# EAGLE design lueur (EAGLE 9.5.2)
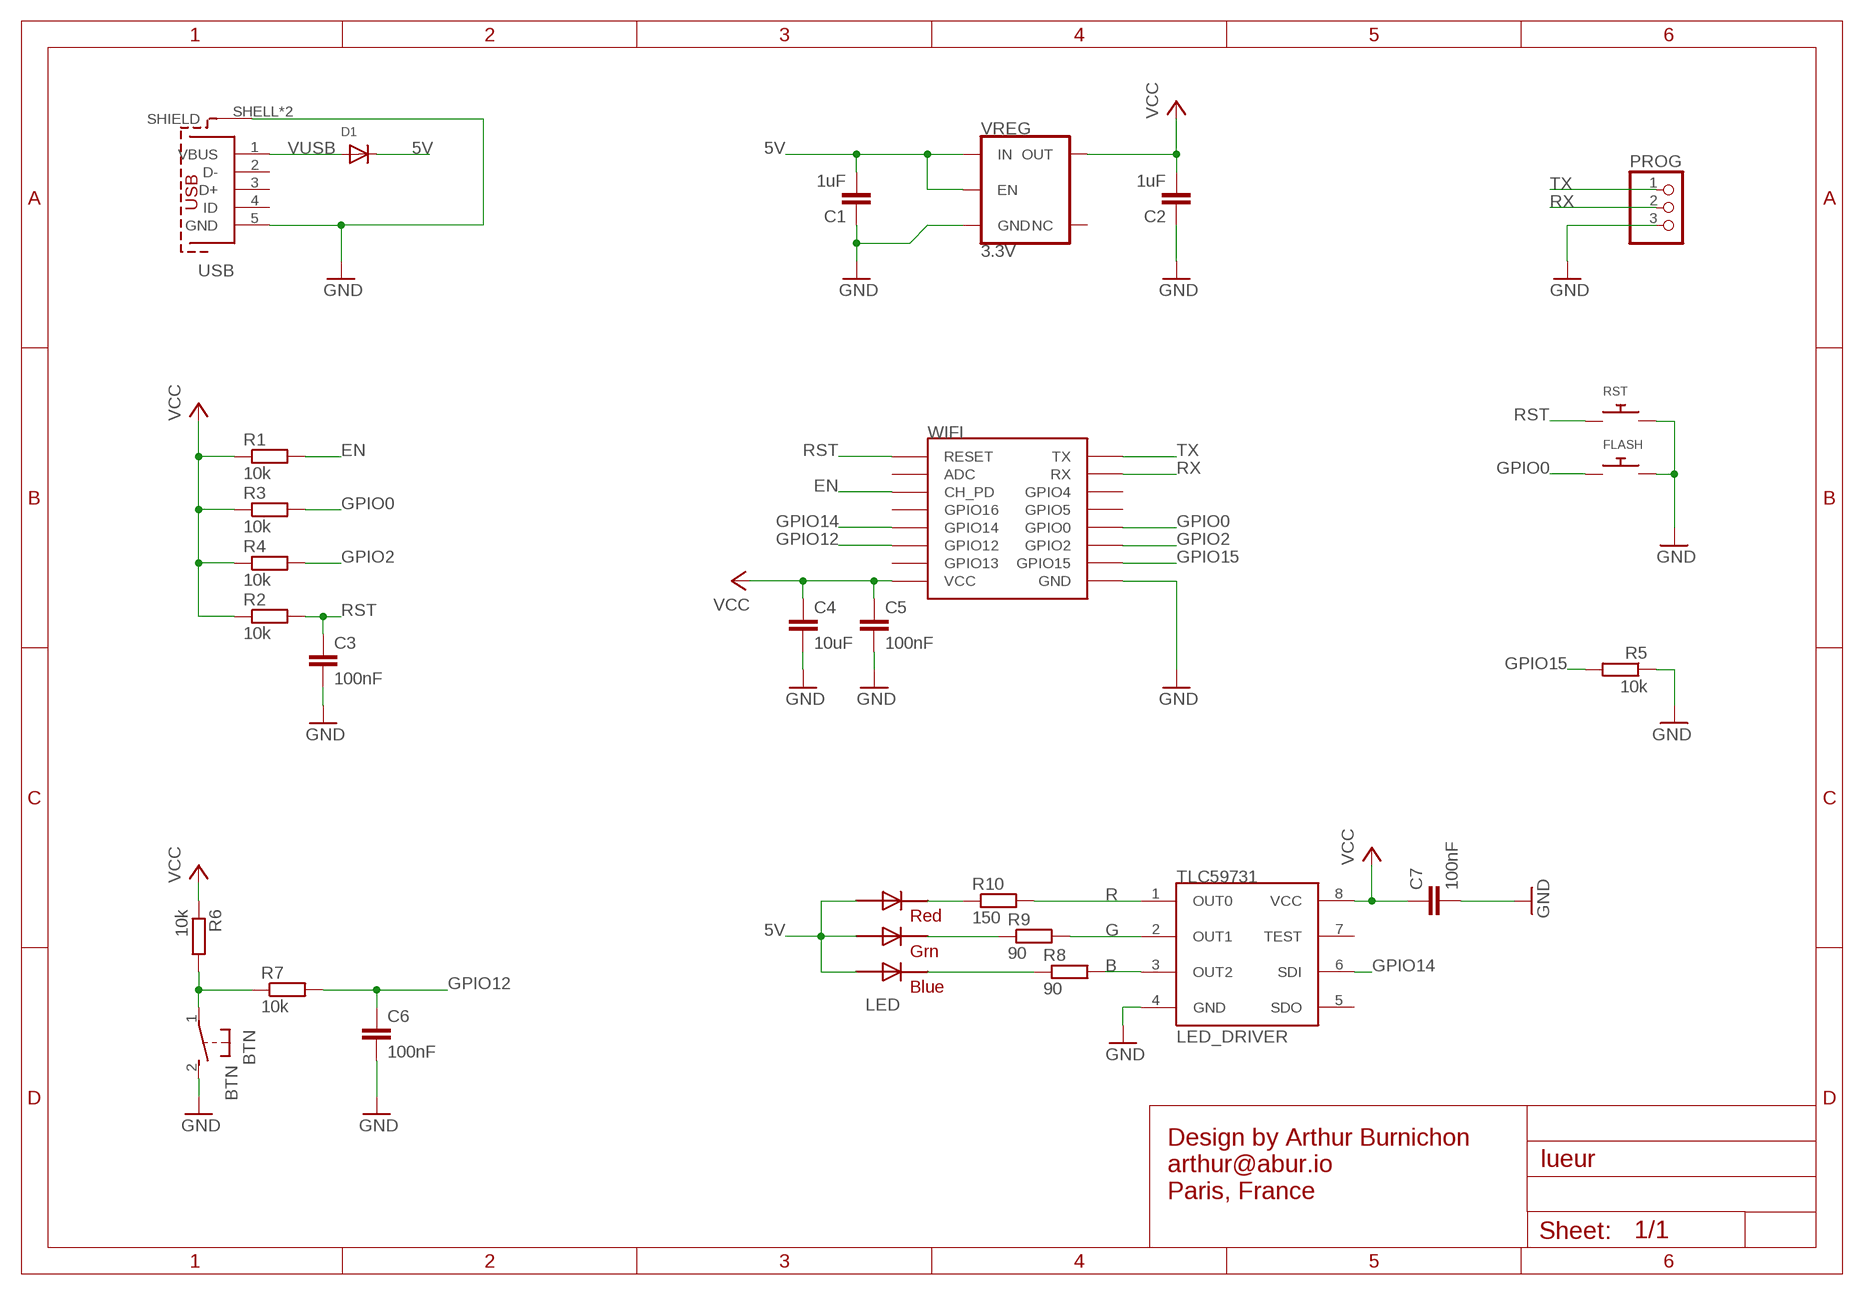
[diagram p0: schematic, sheet 1]

## Parts
BTN  BTN  31-XX  [B3F-31XX]
C1  1uF  C-EUC0805  [C0805]
C2  1uF  C-EUC0805  [C0805]
C3  100nF  C-EUC0805  [C0805]
C4  10uF  C-EUC0805  [C0805]
C5  100nF  C-EUC0805  [C0805]
C6  100nF  C-EUC0805  [C0805]
C7  100nF  C-EUC0805  [C0805]
D1  DIODESMA  [SMADIODE]
FLASH  SWITCH_PUSHBUTTONSOFTTOUCHSMD_SJ  [PUSHBUTTON_SMD_SJ]
LED  RGB5555  [RGBLED5050]
LED_DRIVER  TLC59731  [SOIC8]
PROG  PINHD-1X3  [1X03]
R1  10k  R-EU_R0805  [R0805]
R2  10k  R-EU_R0805  [R0805]
R3  10k  R-EU_R0805  [R0805]
R4  10k  R-EU_R0805  [R0805]
R5  10k  R-EU_R0805  [R0805]
R6  10k  R-EU_R0805  [R0805]
R7  10k  R-EU_R0805  [R0805]
R8  90  R-EU_R0805  [R0805]
R9  90  R-EU_R0805  [R0805]
R10  150  R-EU_R0805  [R0805]
RST  SWITCH_PUSHBUTTONSOFTTOUCHSMD_SJ  [PUSHBUTTON_SMD_SJ]
USB  614105150721  [614105150721]
VREG  3.3V  V_REG_AP2112K-3.3V  [SOT23-5]
WIFI  ESP12SMD  [ESP12-SMD]

## Nets
5V: C1.2 D1.C LED.4(RED_A) LED.5(GREEN_A) LED.6(BLUE_A) VREG.1(IN) VREG.3(EN)
B: LED_DRIVER.3(OUT2) R8.2
BTN: BTN.1(P) R6.2 R7.1
EN: R1.2 WIFI.CH_PD
G: LED_DRIVER.2(OUT1) R9.2
GND: BTN.2(S) C1.1 C2.1 C3.2 C4.2 C5.2 C6.2 C7.2 FLASH.P$2 LED_DRIVER.4(GND) PROG.3 R5.1 RST.P$2 USB.5(GND) USB.SHELL1(SHIELD) USB.SHELL(SHIELD) VREG.2(GND) WIFI.GND
GPIO0: FLASH.P$1 R3.2 WIFI.GPIO0
GPIO2: R4.2 WIFI.GPIO2
GPIO12: C6.1 R7.2 WIFI.GPIO12
GPIO14: LED_DRIVER.6(SDI) WIFI.GPIO14
GPIO15: R5.2 WIFI.GPIO15
N$3: LED.3(RED_C) R10.1
N$7: LED.2(GREEN_C) R9.1
N$8: LED.1(BLUE_C) R8.1
R: LED_DRIVER.1(OUT0) R10.2
RST: C3.1 R2.2 RST.P$1 WIFI.RESET
RX: PROG.2 WIFI.RXD0(RX)
TX: PROG.1 WIFI.TXD0(TX)
VCC: C2.2 C4.1 C5.1 C7.1 LED_DRIVER.8(VCC) R1.1 R2.1 R3.1 R4.1 R6.1 VREG.5(OUT) WIFI.VCC
VUSB: D1.A USB.1(VBUS)
Unconnected: LED_DRIVER.5(SDO) LED_DRIVER.7(TEST) USB.2(D-) USB.3(D+) USB.4(ID) VREG.4(NC) WIFI.ADC WIFI.GPIO4 WIFI.GPIO5 WIFI.GPIO13 WIFI.GPIO16

## Notes on the sheet
- Design by Arthur Burnichon
  arthur@abur.io
  Paris, France

## Library data of the parts
BTN = adafruit:31-XX: OMRON SWITCH Now with beefier pads!
C1-C7 = rcl:C-EU: CAPACITOR, European symbol
D1 = adafruit:DIODE: Diode SMADIODE - SMA Surface Mount Package 20V 1A Schottky Diode Digikey: 641-1014-6-ND DO-1N4148 - Through Hole Small Current Diode SOD-123 20V 1 A (.5mV Vf) Schottky Diode - Digikey: MBRX120TPMSCT-ND SOD-323 10V 570mA (.38mV Vf, 3ns) Schottky Diode - Digikey: ZLLS410CT-ND SOD-523 30V 30mA Schottky Diode (RB751S-40TE61) - Digikey: RB751S-40TE61CT-ND SOT23-R/W - SOT23 Package (R = Solder Paste/Reflow Ovens, W = Hand-Soldering) BAT54Film 40V 300mA - Digikey: 497-7162-1-ND
FLASH RST = adafruit:SWITCH_PUSHBUTTON: Buttons SOFTTOUCHSMD_SJ - Soft touch temporary push button (Super Junk Akihabara) Compatible with SKPMANE010 [Mouser: 688-SKPMAN] C&K_KSS = Digikey: KSS221GLFS
LED = luseed:RGB5555
LED_DRIVER = luseed:TLC59731
PROG = pinhead:PINHD-1X3: PIN HEADER
R1-R10 = rcl:R-EU_: RESISTOR, European symbol
USB = EAGLE-INPUT_OUTPUT_CONNECTORS-rev16c:614105150721: WR-COM_USB_Micro Type B_Vertical_THT; Micro Type B Vertical THT- Tape & Reel not for Pick & Place machine Code : Con_I-O_COM_USB_2.0_B_614105150721_614105150721 <http://katalog.we-online.de/media/images/eican/Con_I-O_COM_USB_2.0_B_614105150721_pf2.jpg> Details see: http://katalog.we-online.de/em/datasheet/614105150721.pdf Created 12/08/2014, Dan Xu 2014 (C) Wurth Elektronik
VREG = SparkFun-IC-Power:V_REG_AP2112: AP2112 - 600mA CMOS LDO Regulator w/ Enable The AP2112 is CMOS process low dropout linear regulator with enable function, the regulator delivers a guaranteed 600mA (min.) continuous load current. Features Output Voltage Accuracy: ±1.5% Output Current: 600mA (Min.) Foldback Short Current Protection: 50mA Enable Function to Turn ON/OFF VOUT Low Dropout Voltage (3.3V): 250mV (Typ.) @IOUT=600mA Excellent Load Regulation: 0.2%/A (Typ.) Excellent Line Regulation: 0.02%/V (Typ.) Low Quiescent Current: 55μA (Typ.) Low Standby Current: 0.01μA (Typ.) Low Output Noise: 50μVRMS PSRR: 100Hz -65dB, 1kHz -65dB OTSD Protection Stable with 1.0μF Flexible Cap: Ceramic, Tantalum and Aluminum Electrolytic Operation Temperature Range: -40°C to 85°C ESD: MM 400V, HBM 4000V; PROD_ID: VREG-12457
WIFI = esp8266modules:ESP12: ESP8266 Wifi module 12

## Board
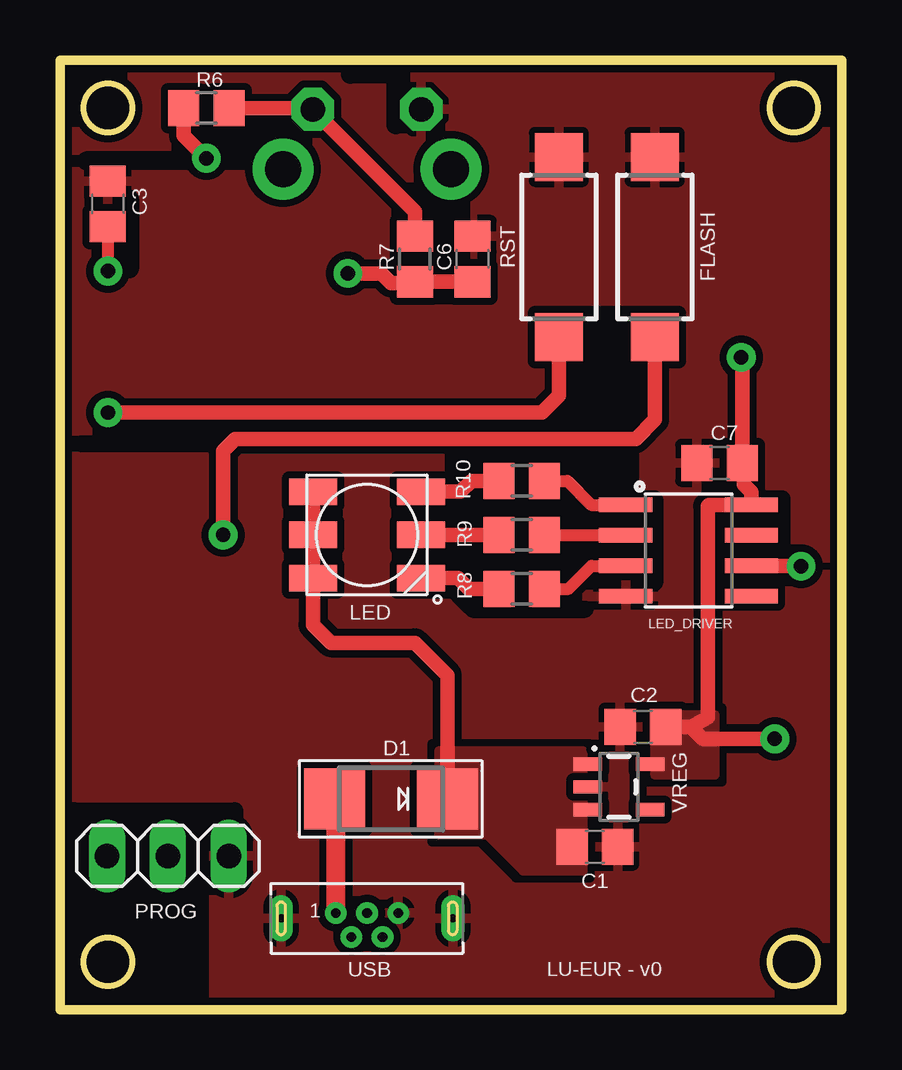
[diagram p1: board, top side]
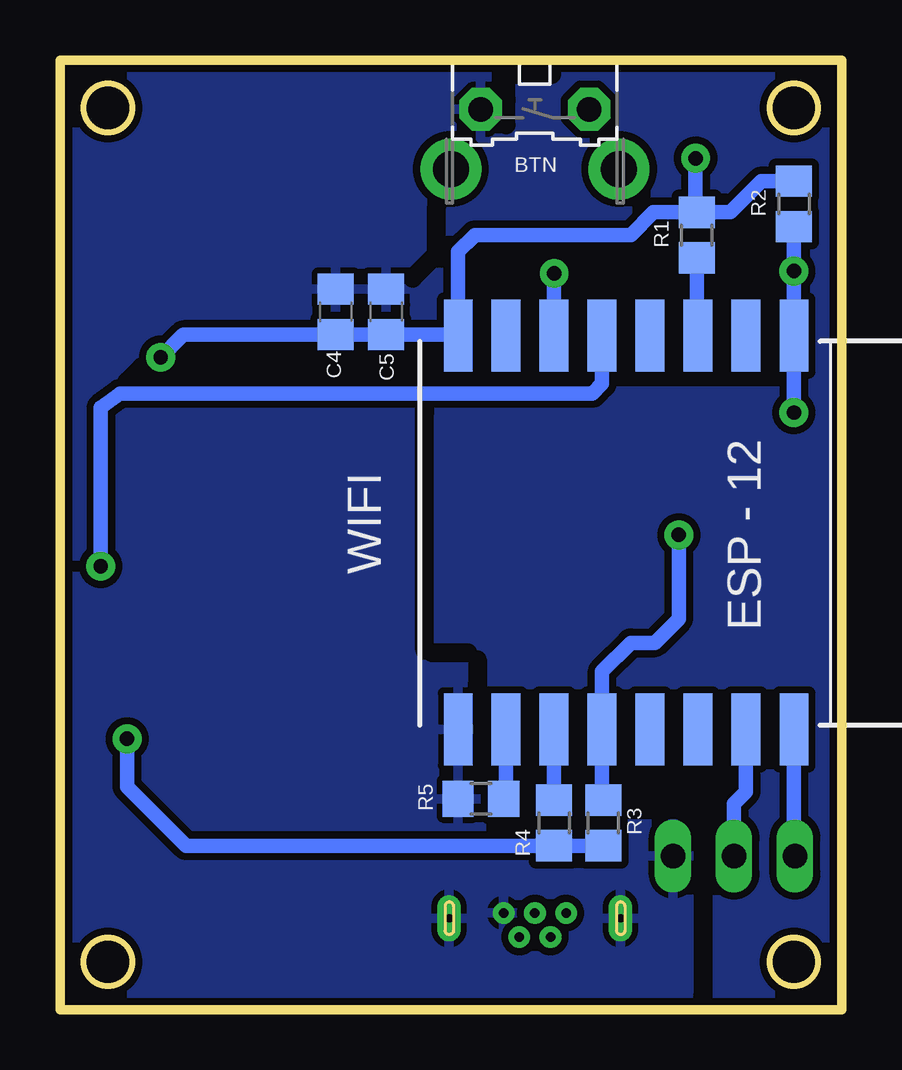
[diagram p2: board, bottom side, seen from below]

Size 32.6 x 39.6 mm. Coordinates in mm from the lower left corner, seen from the top.
Outline: 0,0 0,39.6 32.6,39.6 32.6,0 0,0
Outline: circle at 2,37.6 radius 1
Outline: circle at 30.6,37.6 radius 1
Outline: circle at 30.6,2 radius 1
Outline: circle at 2,2 radius 1
Copper layers (1*16): Top 0.035mm / dielectric 1.5mm / Bottom 0.035mm
Design rules "SeeedStudio_2layer_DRU_no_angle_20140221": minimum track width 6mil, minimum drill 12mil, track to track 6mil, track to pad 6mil, pad to pad 6mil, via to via 6mil, smd to smd 0mil, copper to edge 10mil, drill to drill 10mil, minimum pad ring 10mil, minimum via ring 6mil, stop-mask expansion 2mil, vias tented up to drill 100mil, thermal gap 10mil
Holes 2 mm at 2,37.6 30.6,37.6 30.6,2 2,2
tRestrict: 21 lines
bRestrict: 12 lines

### Footprints (pad centres in the part's own frame; a part is rotated, then mirrored left to right if it is on the bottom)
B3F-31XX = drill 1.016 pad 1.778 octagon: 1 -2.261,-1.245; 2 2.261,-1.245 | drill 1.499 pad 2.54: 3 -3.505,1.245; 4 3.505,1.245
C0805 = smd 1.3 x 1.5: 1 -0.95,0; 2 0.95,0
SMADIODE = smd 2.54 x 2.54: A 2.349,0; C -2.349,0
PUSHBUTTON_SMD_SJ = smd 2 x 2: P$1 3.75,0; P$2 -3.75,0
RGBLED5050 = smd 2 x 1.1: 1 2.25,-1.8; 2 2.25,0; 3 2.25,1.8; 4 -2.25,1.8; 5 -2.25,0; 6 -2.25,-1.8
SOIC8 = smd 0.61 x 2.21: 1 -1.905,-2.616; 2 -0.635,-2.616; 3 0.635,-2.616; 4 1.905,-2.616; 5 1.905,2.616; 6 0.635,2.616; 7 -0.635,2.616; 8 -1.905,2.616
1X03 = drill 1.016 long: 1 -2.54,0; 2 0,0; 3 2.54,0
R0805 = smd 1.3 x 1.5: 1 -0.95,0; 2 0.95,0
614105150721 = drill 0.4: 1 -1.3,0.22; 2 -0.65,-0.78; 3 0,0.22; 4 0.65,-0.78; 5 1.3,0.22 | drill 0.35 pad 0.97 long: SHELL -3.575,0; SHELL1 3.575,0
SOT23-5 = smd 0.55 x 1.2: 1 -0.95,-1.3; 2 0,-1.3; 3 0.95,-1.3; 4 0.95,1.3; 5 -0.95,1.3
ESP12-SMD = smd 3 x 1.2: ADC -8.3,3.8; CH_PD -8.3,1.8; GND 8.1,-8.2; GPIO0 8.1,-2.2; GPIO2 8.1,-4.2; GPIO4 8.1,1.8; GPIO5 8.1,-0.2; GPIO12 -8.3,-4.2; GPIO13 -8.3,-6.2; GPIO14 -8.3,-2.2; GPIO15 8.1,-6.2; GPIO16 -8.3,-0.2; RESET -8.3,5.8; RXD0 8.1,3.8; TXD0 8.1,5.8; VCC -8.3,-8.2

### Placement (x,y rotation side)
BTN  12.8,36.3 180 bottom
C1  22.3,6.8 180 top
C2  24.3,11.8 0 top
C3  2,33.6 90 top
C4  21.1,29.1 90 bottom
C5  19,29.1 90 bottom
C6  17.2,31.3 90 top
C7  27.5,22.8 180 top
D1  13.8,8.8 180 top
FLASH  24.8,31.8 270 top
LED  12.8,19.8 0 top
LED_DRIVER  26.2,19.15 270 top
PROG  4.5,6.42 0 top
R1  6.05,32.3 270 bottom
R2  2,33.6 270 bottom
R3  9.95,7.8 90 bottom
R4  12,7.8 90 bottom
R5  15.05,8.8 0 bottom
R6  6.1,37.6 0 top
R7  14.8,31.3 270 top
R8  19.25,17.55 0 top
R9  19.25,19.8 0 top
R10  19.25,22.05 0 top
RST  20.8,31.8 270 top
USB  12.8,3.82 0 top
VREG  23.3,9.3 270 top
WIFI  7.8,19.8 270 bottom

### Tracks (layer width: path | path; a pad name or v marks a point on that pad's centre or on a via)
5V
  Top 0.6: LED.4 LED.5 LED.6 10.55,16.05 11.3,15.3 14.8,15.3 16.15,13.95 D1.C
  pour Top (isolate 0.3, no thermals): 15.8,10.8 21.8,10.8 21.8,5.8 19.3,5.8 17.8,7.3 15.8,7.3
B
  Top 0.5: LED_DRIVER.3 22.16,18.52 21.2,17.55 R8.2
BTN
  Top 0.6: R6.2 10.48,37.6 BTN.1 14.8,33.28 R7.1
EN
  Bottom 0.6: R1.2 6.05,28.15 WIFI.CH_PD
G
  Top 0.5: R9.2 23.67,19.8 LED_DRIVER.2
GND
  pour Top (isolate 0.3, rank 4): 0,39.6 0,0 32.6,0 32.6,39.6
  pour Bottom (isolate 0.3): 0,39.6 0,0 32.6,0 32.6,39.6
GPIO0  (via drill 0.6 pad 1.2)
  Top 0.6: 6.8,23.3 v6.8,19.8
  Top 0.61: 6.8,23.3 7.3,23.8 24,23.8 24.8,24.6 FLASH.P$1
  Bottom 0.6: WIFI.GPIO0 10,8.8 R3.2 | 8.8,15.3 7.8,15.3 6.8,16.3 v6.8,19.8
  Bottom 0.61: WIFI.GPIO0 10,14.1 8.8,15.3
GPIO2
  Bottom 0.6: WIFI.GPIO2 R4.2
GPIO12  (via drill 0.6 pad 1.2)
  Top 0.6: C6.1 R7.2 14.75,30.3 13.8,30.3 13.4,30.7 v12,30.7
  Bottom 0.6: v12,30.7 WIFI.GPIO12
GPIO14  (via drill 0.6 pad 1.2)
  Top 0.6: v30.9,18.5 28.63,18.5 LED_DRIVER.6
  Bottom 0.6: WIFI.GPIO14 10,26.1 10.4,25.7 30.1,25.7 30.9,25.1 v30.9,18.5
GPIO15
  Bottom 0.6: WIFI.GPIO15 14,8.9 R5.2
N$3
  Top 0.6: R10.1 17.15,22.05 16.7,21.6 LED.3
N$7
  Top 0.6: R9.1 LED.2
N$8
  Top 0.6: R8.1 17.05,17.55 16.6,18 LED.1
R
  Top 0.5: LED_DRIVER.1 22.14,21.05 21.15,22.05 R10.2
RST  (via drill 0.6 pad 1.2)
  Top 0.5: C3.1 v2,30.8
  Top 0.61: RST.P$1 20.8,25.6 20.1,24.9 v2,24.9
  Bottom 0.6: C3.1 v2,30.8 WIFI.RESET
  Bottom 0.61: WIFI.RESET v2,24.9
RX
  Bottom 0.6: WIFI.RXD0 4,9.1 4.5,8.6 PROG.2
TX
  Bottom 0.6: WIFI.TXD0 2,5.69 PROG.1
VCC  (via drill 0.6 pad 1.2)
  Top 0.4: 27.06,21.05 27,21
  Top 0.6: R6.1 5.15,36.45 v6.1,35.5 | v29.8,11.3 26.8,11.3 26.3,11.8 | C7.1 28.45,27.15 v28.4,27.2
  Top 0.61: C7.1 28.5,22.65 28.5,21.9 28.82,21.58 LED_DRIVER.8 27.06,21.05 | 27,21 27,12.2 26.3,11.8 C2.2
  Bottom 0.6: v6.1,35.5 6.1,33.3 R1.1 | R2.1 3.35,34.55 4.65,33.25 R1.1 | R1.1 7.85,33.25 8.8,32.3 15.3,32.3 16,31.6 WIFI.VCC | R3.1 R4.1 27.35,6.85 29.8,9.3 v29.8,11.3 | 27.5,28.1 v28.4,27.2
  Bottom 0.61: WIFI.VCC 16.05,28.15 C5.1 C4.1 27.45,28.15 27.5,28.1
  pour Top (isolate 0.5, no thermals): 24.8,12.3 24.8,9.8 27.3,9.8 27.3,12.3
VUSB
  Top 0.8: USB.1 11.5,8.75 D1.A

### Text on the board
tNames: LU-EUR - v0
Reference: Lueur v0 / Design by Arthur Burnichon / arthur@abur.io